# Altium schematic sheet Sheet1.SchDoc
size A3; SheetNumber: 1; SheetTotal: 1; SPICEModelCacheCNQVOYKR: <root> / <DocumentId>CNQVOYKR</DocumentId> / </root>
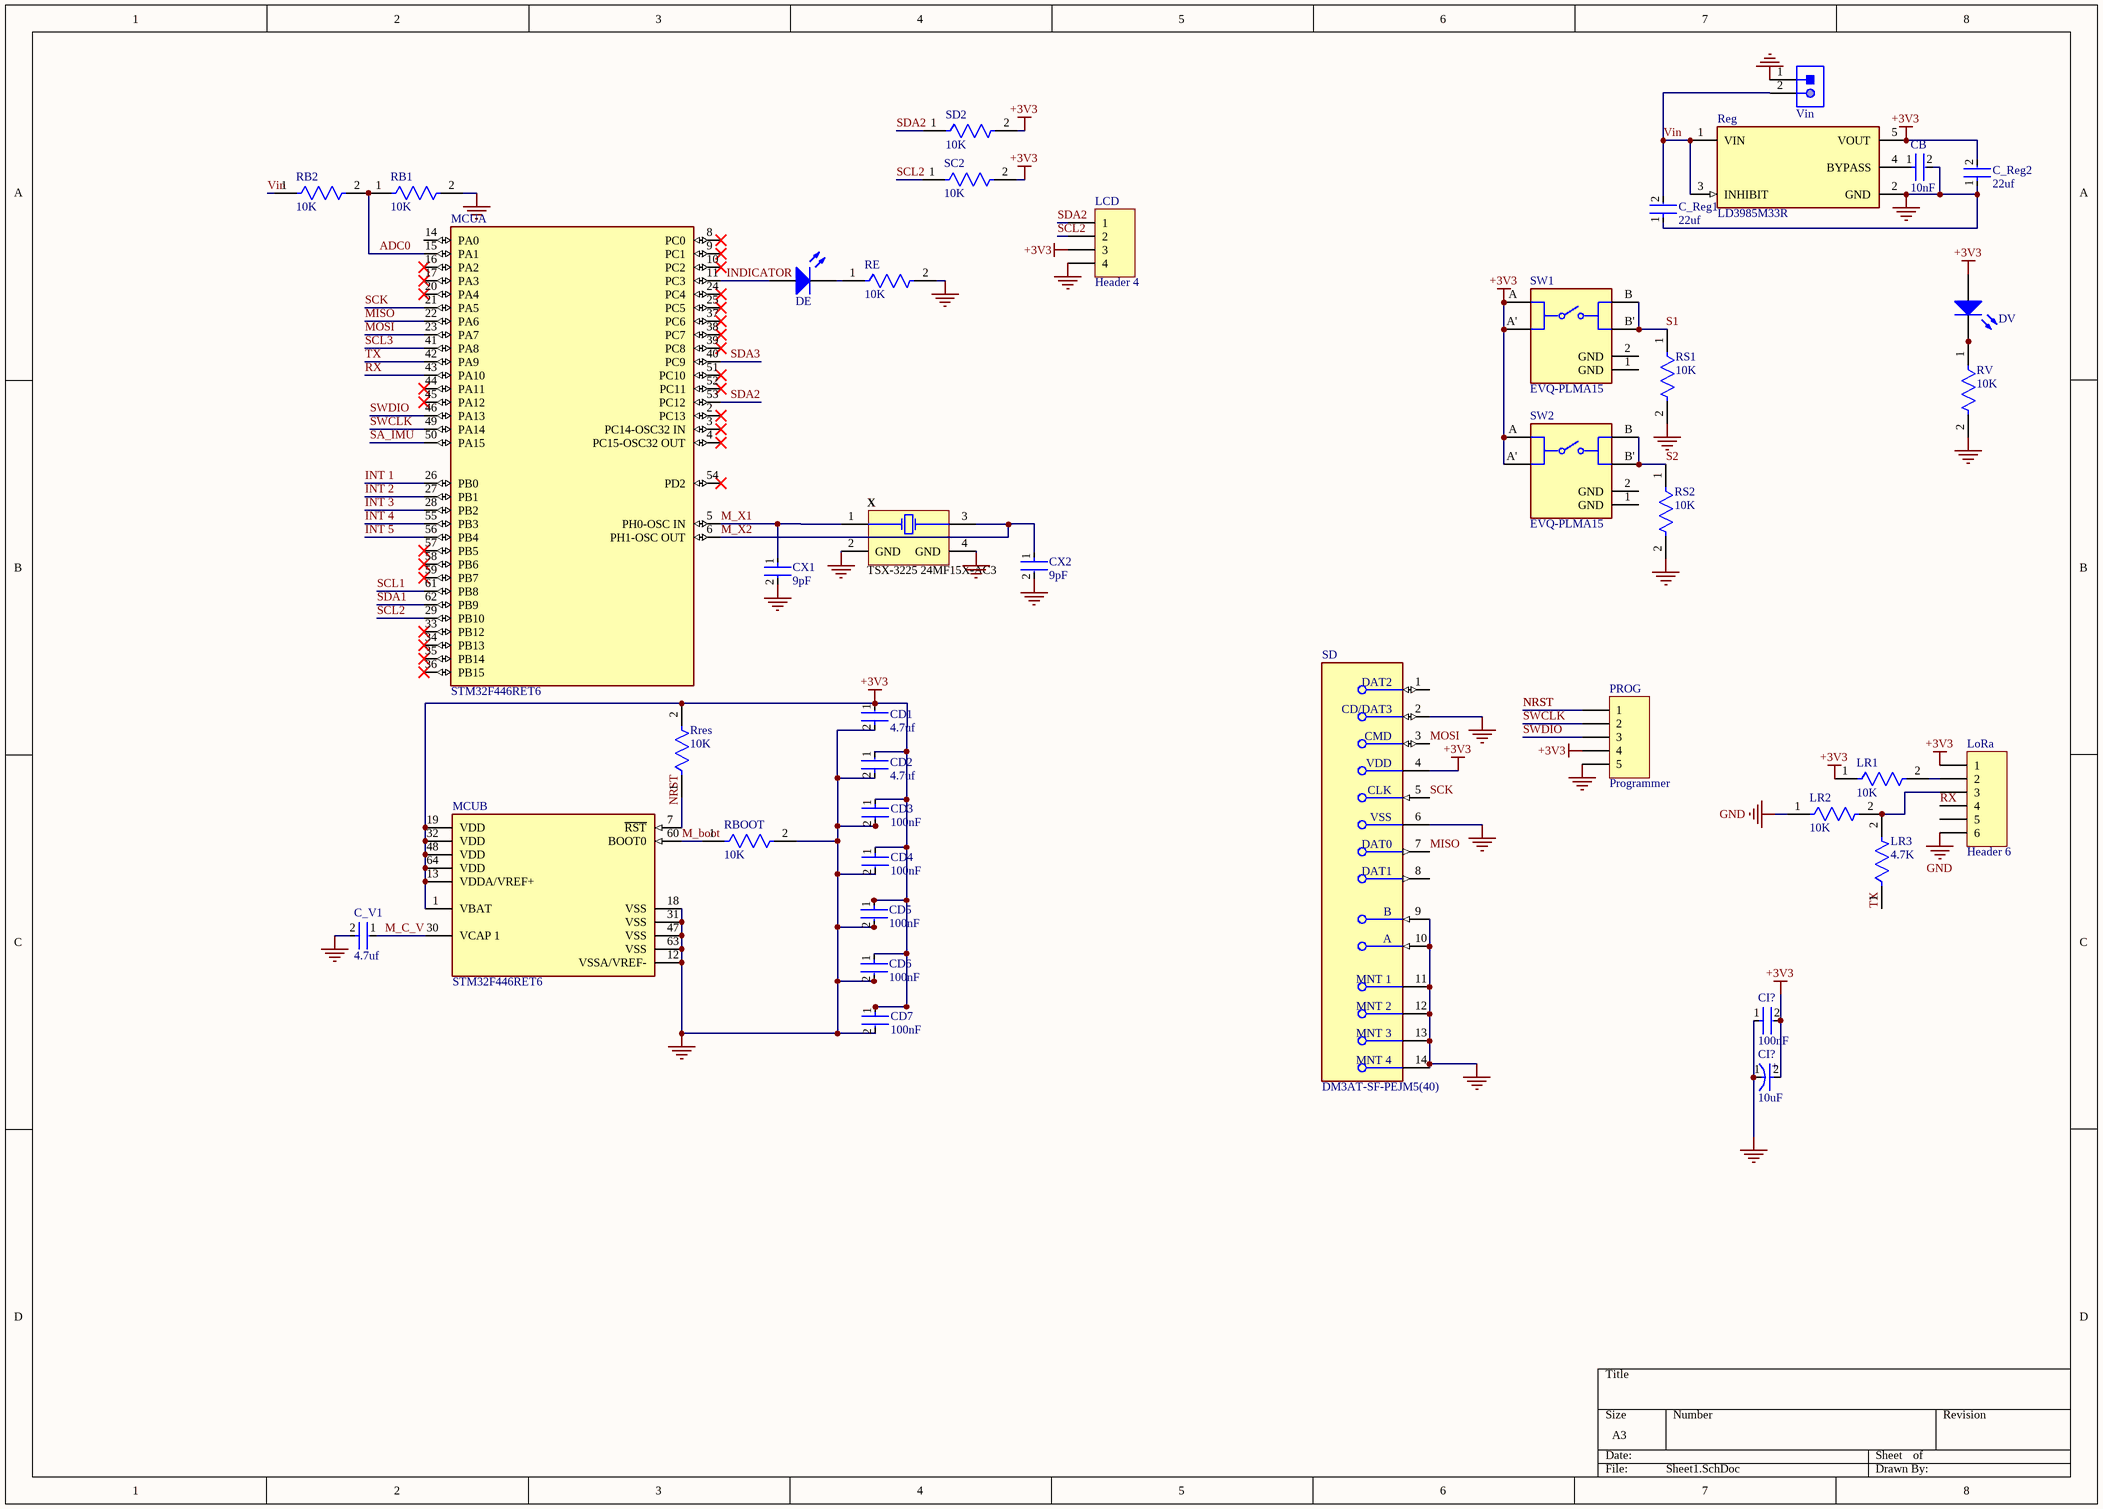
[diagram p0: Sheet1.SchDoc]

## Parts
(Parts that share a designator on the sheet are numbered #1, #2 ... from top to bottom, then left to right.)
C_Reg1  22uf  [FP-C2012-125-0_2-IPC_A]
C_Reg2  22uf  [FP-C2012-125-0_2-IPC_A]
C_V1  4.7uf  [FP-C1608-080-0_1-IPC_C]
CB  10nF  [FP-CC0603-DA-MFG]
CD1  4.7uf  [FP-C1608-080-0_1-IPC_C]
CD2  4.7uf  [FP-C1608-080-0_1-IPC_C]
CD3  100nF  [FP-CGA3E-0_3-0_1-IPC_A]
CD4  100nF  [FP-CGA3E-0_3-0_1-IPC_A]
CD5  100nF  [FP-CGA3E-0_3-0_1-IPC_A]
CD6  100nF  [FP-CGA3E-0_3-0_1-IPC_A]
CD7  100nF  [FP-CGA3E-0_3-0_1-IPC_A]
CI?#1  100nF  [FP-CGA3E-0_3-0_1-IPC_A]
CI?#2  10uF  [FP-SC-MFG]
CX1  9pF  [FP-CGA3E-0_3-0_1-IPC_B]
CX2  9pF  [FP-CGA3E-0_3-0_1-IPC_B]
DE  150080BS75000  [0805_A]  (value not drawn)
DV  150080BS75000  [0805_A]  (value not drawn)
LCD  Header 4  [HDR1X4]
LoRa  Header 6  [HDR1X6]
LR1  10K  [FP-RC0603-0_55-IPC_C]
LR2  10K  [FP-RC0603-0_55-IPC_C]
LR3  4.7K  [FP-RC0603-0_55-IPC_C]
MCU  STM32F446RET6  [FP-LQFP64-5W-MFG]  (parts A,B of 2)
PROG  Programmer  [HDR1X5]
RB1  10K  [FP-RC0603-0_55-IPC_C]
RB2  10K  [FP-RC0603-0_55-IPC_C]
RBOOT  10K  [FP-RC0603-0_55-IPC_C]
RE  10K  [FP-RC0603-0_55-IPC_C]
Reg  LD3985M33R  [FP-SOT23-5L-7049676-MFG]
Rres  10K  [FP-RC0603-0_55-IPC_C]
RS1  10K  [FP-RC0603-0_55-IPC_C]
RS2  10K  [FP-RC0603-0_55-IPC_C]
RV  10K  [FP-RC0603-0_55-IPC_C]
SC2  10K  [FP-RC0603-0_55-IPC_C]
SD  DM3AT-SF-PEJM5(40)  [FP-DM3AT-SF-PEJM5_40-MFG]
SD2  10K  [FP-RC0603-0_55-IPC_C]
SW1  EVQ-PLMA15  [FP-EVQ-PLMA15-MFG]
SW2  EVQ-PLMA15  [FP-EVQ-PLMA15-MFG]
Vin  620302124022  [620302124022]  (value not drawn)
X  TSX-3225 24MF15X-AC3  [EPSON-TSX-3225_V]

## Nets
+3V3: C_Reg2.2 CD1.1 CD2.1 CD3.1 CD4.1 CD5.1 CD6.1 CD7.1 CI?#1.2 CI?#2.2(A) DV.2(A) LCD.3 LoRa.1 LR1.1 MCU.1(VBAT) MCU.13(VDDA/VREF+) MCU.19(VDD) MCU.32(VDD) MCU.48(VDD) MCU.64(VDD) PROG.4 Reg.5(VOUT) Rres.2 SC2.2 SD.4(VDD) SD2.2 SW1.A SW1.A' SW2.A SW2.A'
GND: C_Reg1.1 C_Reg2.1 C_V1.2 CB.2 CD1.2 CD2.2 CD3.2 CD4.2 CD5.2 CD6.2 CD7.2 CI?#1.1 CI?#2.1(C) CX1.2 CX2.2 LCD.4 LoRa.6 LR2.1 MCU.12(VSSA/VREF-) MCU.18(VSS) MCU.31(VSS) MCU.47(VSS) MCU.63(VSS) PROG.5 RB1.2 RBOOT.2 RE.2 Reg.2(GND) RS1.2 RS2.2 RV.2 SD.2(CD/DAT3) SD.6(VSS) SD.9(B) SD.10(A) SD.11(MNT_1) SD.12(MNT_2) SD.13(MNT_3) SD.14(MNT_4) Vin.1 X.2(GND) X.4(GND)
ADC0: MCU.15(PA1) RB1.1 RB2.2
INDICATOR: DE.2(A) MCU.11(PC3)
INT 1: MCU.26(PB0)
INT 2: MCU.27(PB1)
INT 3: MCU.28(PB2)
INT 4: MCU.55(PB3)
INT 5: MCU.56(PB4)
M_boot: MCU.60(BOOT0) RBOOT.1
M_C_V: C_V1.1 MCU.30(VCAP_1)
M_X1: CX1.1 MCU.5(PH0-OSC_IN) X.1(X1)
M_X2: CX2.1 MCU.6(PH1-OSC_OUT) X.3(X2)
MISO: MCU.22(PA6) SD.7(DAT0)
MOSI: MCU.23(PA7) SD.3(CMD)
NRST: MCU.7(~{RST}) PROG.1 Rres.1
RX: LoRa.4 MCU.43(PA10)
S1: RS1.1 SW1.B SW1.B'
S2: RS2.1 SW2.B SW2.B'
SA_IMU: MCU.50(PA15)
SCK: MCU.21(PA5) SD.5(CLK)
SCL1: MCU.61(PB8)
SCL2: LCD.2 MCU.29(PB10) SC2.1
SCL3: MCU.41(PA8)
SDA1: MCU.62(PB9)
SDA2: LCD.1 MCU.53(PC12) SD2.1
SDA3: MCU.40(PC9)
SWCLK: MCU.49(PA14) PROG.2
SWDIO: MCU.46(PA13) PROG.3
TX: LR3.1 MCU.42(PA9)
Vin: C_Reg1.2 RB2.1 Reg.1(VIN) Reg.3(INHIBIT) Vin.2
NetCB_1: CB.1 Reg.4(BYPASS)
NetDE_1: DE.1(K) RE.1
NetDV_1: DV.1(K) RV.1
NetLoRa_2: LoRa.2 LR1.2
NetLoRa_3: LoRa.3 LR2.2 LR3.2

Not connected (* = marked no-connect by the designer): LoRa 5; MCU 2(PC13)* 3(PC14-OSC32_IN)* 4(PC15-OSC32_OUT)* 8(PC0)* 9(PC1)* 10(PC2)* 14(PA0) 16(PA2)* 17(PA3)* 20(PA4)* 24(PC4)* 25(PC5)* 33(PB12)* 34(PB13)* 35(PB14)* 36(PB15)* 37(PC6)* 38(PC7)* 39(PC8)* 44(PA11)* 45(PA12)* 51(PC10)* 52(PC11)* 54(PD2)* 57(PB5)* 58(PB6)* 59(PB7)*; SD 1(DAT2) 8(DAT1); SW1 1(GND) 2(GND); SW2 1(GND) 2(GND)

## Notes on the sheet
- (in symbol CMP-05427-000087-1) +

## Library data of the parts
C_Reg1 C_Reg2 = CMP-08246-007072-1: Multilayer Ceramic Capacitors 22μF ±20% 16V X6S SMD 0805; Mount: Surface Mount; Width: 0.049inch; Packaging: Tape and Reel; Package Quantity: 2000; Voltage Rating: 16V; RoHS Compliant: Yes; Case Code (Imperial): 0805; Case Code (Metric): 2012; Case/Package: 0805; Dielectric: X6S; Capacitance: 22uF; Dielectric Material: Ceramic; Max Operating Temperature: 105°C; Lead Free: Lead Free; Min Operating Temperature: -55°C; Tolerance: 20%; Height: 1.25mm; Thickness: 0.057inch; Termination: SMD/SMT; Series: C; REACH SVHC: No SVHC; Weight: 0.000194oz; Voltage Rating (DC): 16V; Length: 0.079inch
C_V1 CD1 CD2 = CMP-2000-04981-2: Multilayer Ceramic Capacitors 4.7μF ±10% 16V X5R SMD 0603; Tolerance: 10%; Thickness: 0.035inch; Length: 1.6mm; Width: 0.031inch; Height: 0.8mm; Package Quantity: 1; Voltage: 16V; Construction: Flat; Weight: 7.1E-05oz; Depth: 0.8mm; Case Code (Metric): 1608; Series: C; Lead Free: Lead Free; Voltage Rating: 16V; Voltage Rating (DC): 16V; Capacitance: 4.7uF; Termination: SMD/SMT; Dielectric: X5R; REACH SVHC: No SVHC; RoHS Compliant: Yes; Case Code (Imperial): 0603; Case/Package: 0603; Mount: Surface Mount; Dielectric Material: Ceramic; Packaging: Tape and Reel; Min Operating Temperature: -55°C; Max Operating Temperature: 85°C
CB = CMP-2100-03600-2: CAP CER 10000PF 50V X7R 0603; Manufacturer Part Number: CC0603KRX7R9BB103; Manufacturer: YAGEO; Tolerance: 0.1; Temperature Coefficient: 15%; Mouser Description: Multilayer Ceramic Capacitor, CC Series, 0.01 - F, - 10%, X7R, 50 V, 0603 [1608 Metric]; Digikey Description: CAP CER 10000PF 50V X7R 0603; Height: 0.9mm; Category: Cap; Temperature Characteristic: X7R; Footprint Url: http://www.yageo.com/exep/pages/download/literatures/UPY-C_GEN_24.pdf; Lead Free: Yes; Voltage Rating: 50 V; Material: Ceramic; Temperature: -55°C to +125°C; Device Class L3: Ceramic Capacitors; ComponentLink2Description: Datasheet; Voltage: 50 V; Package: CC0603-DA; Octopart: https://octopart.com/cc0603krx7r9bb103-yageo-192938; Automotive: No; Temperature Range High: +125°C; Temperature Range Low: -55°C; Value: 10 nF; RoHS: TRUE; Device Class L1: Passive Components; ComponentLink2URL: http://www.yageo.com/documents/recent/UPY-GPHC_X7R_6.3V-to-50V_18.pdf; Device Class L2: Capacitors; Capacitance: 10 nF
CD3-CD7 CI?#1 = CMP-2000-07546-2: Cap Ceramic 100nF 50V X7R 10% Pad SMD 0603 +125°C Automotive T/R; Weight: 7.1E-05oz; Composition: Ceramic; Max Operating Temperature: 125°C; Termination: SMD/SMT; Dielectric: X7R; Length: 1.6mm; Package Quantity: 1; REACH SVHC: No SVHC; Lead Free: Lead Free; Case Code (Metric): 1608; Min Operating Temperature: -55°C; Packaging: Tape and Reel; Tolerance: 10%; Voltage Rating: 50V; Case Code (Imperial): 0603; Capacitance: 100nF; Case/Package: 0603; Voltage Rating (DC): 50V; Depth: 0.8mm; Radiation Hardening: No; Ratings: AEC-Q200; Mount: Surface Mount; Voltage: 50V; Thickness: 0.035inch; Width: 0.8mm; Height: 0.8mm
CI?#2 = CMP-05427-000087-1: CAP ALUM 10UF 20% 35V SMD; Life (Hours): 2000Hour; Lead Length: 2.2mm; Ripple Current (AC): 30mA; Leakage Current: 3uA; Length: 5.5mm; Construction: Cylindrical; Diameter: 5mm; RoHS Compliant: Yes; REACH SVHC: No SVHC; Capacitance: 10uF; Max Operating Temperature: 85°C; Series: S; Case/Package: Radial; Contact Plating: Tin; Packaging: Tape and Reel; Voltage Rating: 35V; Number of Pins: 2; Height: 5.4mm; Width: 5.3mm; Voltage Rating (DC): 35V; Mount: Surface Mount; Tolerance: 20%; Lead Pitch: 1.5mm; Radiation Hardening: No; Height - Seated (Max): 0.213inch; Ripple Current: 30mA; Voltage: 35V; Package Quantity: 1; Termination: SMD/SMT; Min Operating Temperature: -40°C
CX1 CX2 = CMP-08246-000963-1: Cap Ceramic 9pF 50V C0G 0.5pF Pad SMD 0603 +125°C Automotive T/R; Width: 0.031inch; Package Quantity: 4000; Composition: Ceramic; Depth: 0.8mm; Ratings: AEC-Q200; Packaging: Tape and Reel; Weight: 7.1E-05oz; Mount: Surface Mount; Max Operating Temperature: 125°C; Length: 1.6mm; Voltage Rating (DC): 50V; Voltage Rating: 50V; Case Code (Metric): 1608; REACH SVHC: No SVHC; Case Code (Imperial): 0603; Thickness: 0.035inch; Termination: SMD/SMT; Dielectric: C0G; Min Operating Temperature: -55°C; Case/Package: 0603; Capacitance: 9pF; Height: 0.8mm
DE DV = CMP-1426-00008-1: SMD mono-color Chip LED, WL-SMCW, Blue; Manufacturer: Wuerth Elektronik; Color: Blue; ComponentLink2URL: http://katalog.we-online.com/led/datasheet/150080BS75000.pdf; ComponentLink1URL: http://www.we-online.com; ComponentLink2Description: Datasheet; PackageReference: 0805_A; ComponentLink1Description: Manufacturer URL; PartNumber: 150080BS75000
LCD = Header 4: Header, 4-Pin; LatestRevisionDate: 17-Jul-2002; LatestRevisionNote: Re-released for DXP Platform.; Publisher: Altium Limited
LoRa = Header 6: Header, 6-Pin; LatestRevisionDate: 17-Jul-2002; LatestRevisionNote: Re-released for DXP Platform.; Publisher: Altium Limited
LR1-LR3 RB1 RB2 RBOOT RE Rres RS1 RS2 RV SC2 SD2 = CMP-2100-03664-2: RES 10K OHM 1% 1/10W 0603; Voltage Rating: 75V; Voltage Rating (DC): 50V; Resistance: 10kR; Power Rating: 100mW; Temperature Coefficient: 100ppm/°C; Depth: 0.8mm; Termination: SMD/SMT; Resistor Type: Thick Film; Series: RC; Construction: Rectangular; Features: Moisture Resistant; Packaging: Tape and Reel; Min Operating Temperature: -55°C; Number of Terminations: 2; Lead Pitch: 0.3mm; RoHS Compliant: Yes; Case/Package: 0603; Resistance Tolerance: 1%; Military Standard: Not; Weight: 7.1E-05oz; Number of Pins: 2; Tolerance: 1%; Length: 1.6mm; Case Code (Imperial): 0603; Lead Free: Lead Free; Width: 0.8mm; Max Power Dissipation: 100mW; Height: 0.45mm; Max Operating Temperature: 155°C; Case Code (Metric): 1608; Size Code: 0603
MCU = CMP-12105-000007-1: IC MCU 32BIT 512KB FLASH 64LQFP; Manufacturer: ST; Number Of Spi Channels: 4; Ram Size: 128KBytes; Standoff Height: 0.05mm; Number Of Uart Channels: 6; Number Of Pwm Channels: 32; Max Junction Temp: +105°C; Number Of I/Os: 50; Number Of Usb Channels: 2; Frequency: 180MHz; Number Of A/D Converters: 3; Max Supply Voltage: 3.6V; Number Of Adc Channels: 16; Interface: I2C,SPI,UART,USART,CAN,USB,LIN,IrDA,I2S,Other; Memory Size: 512KBytes; Number Of Timers/Counters: 14; Min Supply Voltage: 1.7V; Core Architecture: ARM Cortex-M4; Data Bus Width: 32bits; Number Of Cores: 1; Ambient Temperature Range Low: -40°C; ComponentLink2URL: https://www.st.com/en/microcontrollers-microprocessors/stm32f446re.html; Category: IC; Height: 1.6mm; Ipc Land Pattern Name: QFP50P1200X1200X160-64; Manufacturer Part Number: STM32F446RET6; Octopart: https://octopart.com/stm32f446ret6-stmicroelectronics-52642920; Temperature Range High: +105°C; Lead Free: Yes; Mouser Description: ARM Microcontrollers - MCU High-performance and DSP with FP, ARM Cortex-M4 MCU with 512 Kbytes Flash, 180 MHz CPU, Art Accelerator, SDRAM; Digikey Description: IC MCU 32BIT 512KB FLASH 64LQFP; Ambient Temperature Range High: +85°C; Number Of I2C Channels: 4; Memory Type: FLASH; RoHS: TRUE; Automotive: No; Device Class L1: Integrated Circuits (ICs); Temperature: -40°C to +105°C; Device Class L2: Embedded Processors and Controllers; Device Class L3: Microcontrollers; Temperature Range Low: -40°C; Package: LQFP64-5W; ComponentLink2Description: Datasheet
PROG = Header 5: Header, 5-Pin; LatestRevisionDate: 17-Jul-2002; LatestRevisionNote: Re-released for DXP Platform.; Publisher: Altium Limited
Reg = CMP-0244-00328-2: IC REG LINEAR 3.3V 150MA SOT23-5; Input Bias Current: 85uA; Output Type: Fixed; Max Input Voltage: 6V; Min Input Voltage: 2.5V; Output Voltage Accuracy: 2%; Quiescent Current: 150uA; Number of Regulators: 1; Min Current Limit: 300mA; Dropout Voltage: 60mV; Polarity: Positive; Min Operating Temperature: -40°C; Height: 1.3mm; Radiation Hardening: No; Package Quantity: 1; Number of Pins: 5; Output Current: 150mA; Width: 1.75mm; Length: 3mm; Mount: Surface Mount; Case/Package: SOT-23; Lead Free: Lead Free; Number of Outputs: 1; Max Operating Temperature: 125°C; Accuracy: 2%; Max Output Current: 150mA; Packaging: Tape and Reel; Output Voltage: 3.3V; Min Output Voltage: 3.3V
SD = CMP-11597-000006-1: CONN MICRO SD R/A PUSH-PUSH SMD; Contact Resistance: 100mR; Insulation Resistance: 1GR; Gender: Receptacle; Max Voltage Rating (AC): 125V; Pitch: 1.1mm; Mating Cycles: 10000; Max Current Rating: 500mA; Connector Type: Connector; Number of Contacts: 8; Housing Material: Polymer; Flammability Rating: UL94 V-0; REACH SVHC: No SVHC; Lead Free: Lead Free; Package Quantity: 400; Length: 13.85mm; Number of Rows: 2; Series: DM3; Min Operating Temperature: -25°C; Voltage Rating (AC): 125V; Contact Material: Copper Alloy; Depth: 15.95mm; Contact Plating: Gold; Packaging: Tape and Reel; Width: 13.85mm; Orientation: Right Angle; Color: Black; Voltage Rating: 125V; Radiation Hardening: No; Termination: Solder; Current Rating: 500mA; Mount: Surface Mount; Max Operating Temperature: 85°C
SW1 SW2 = CMP-05618-000006-1: SWITCH TACTILE SPST-NO 0.02A 15V; Manufacturer: Panasonic Electronic Components; Operating Force: 2.6N; Contact Resistance: 50mΩ; Contact Current Rating: 20mA; Electromechanical Life: 200000Cycles; Throw Configuration: SPST-NO; Automotive: No; Digikey Description: SWITCH TACTILE SPST-NO 0.02A 15V; Device Class L3: Tactile Switches; Device Class L2: Switches; Temperature Range Low: -20°C; ComponentLink2Description: Datasheet; RoHS: TRUE; Mount: Surface Mount; Package: 0; Height: 1.7mm; Octopart: https://octopart.com/evq-plma15-panasonic-39850235; Temperature Range High: +70°C; Device Class L1: Electromechanical; Category: Switch; Mouser Description: Tactile Switches FLAT ACT 2.6NF 4.6x3.4x1.5mm; Voltage Rating Dc: 15V; Manufacturer Part Number: EVQ-PLMA15; ComponentLink2URL: https://datasheet.ciiva.com/8164/atv0000ce2-8164994.pdf; Lead Free: Yes; Temperature: -20°C to +70°C
Vin = CMP-1502-00660-1: Male Shrouded Header WR-WTB, SMT, Vertical, pitch 2 mm, 1 x 2 position; Manufacturer: Wurth Elektronik; Pitch: 2mm; Position: 1x2; Working Voltage: 100VAC; Contact Resistance: 20mOhm; Package Reference: 620302124022; Manufacturer URL: http://www.we-online.de; Gender: Male; Orientation: Vertical; Publisher: WurthElektronik; Mounting Technology: SMT; Operating Temperature: -25to85degC; Datasheet URL: https://katalog.we-online.de/em/datasheet/6203xx124022.pdf; Packaging: TapeandReel; Part Number: 620302124022
X = CMP-2000-07333-1: MHz Range Crystal, 24 MHz, -40 to 85 degC, 4-Pin SMD, RoHS, Tape and Reel; Manufacturer: Epson; Brand: EpsonTiming; Frequency Stability: 10PPM; Frequency: 24MHz; ESR: 40Ohms; Load Capacitance: 9pF; Unit Weight: 0.000564oz; Drive Level: 200uW; Datasheet Version: 12/2015; RoHS: True; Operating Temperature Range: -40Cto+85C; Length: 3.2mm; Tolerance: 10PPM; Width: 2.5mm; Mounting Technology: SurfaceMount; Package Description: 4-Pin Surface Mount Device, Body 3.2 x 2.5 mm; Manufacturer URL: https://www.eea.epson.com/; Factory Pack Quantity: 250; Package Reference: TSX-3225; Height: 0.6mm; Mounting Style: SMD/SMT; Termination Style: SMD/SMT; Datasheet URL: https://support.epson.biz/td/api/doc_check.php?dl=brief_FA-238V_en.pdf; Type: Crystal; Series: TSX-3225; Package / Case: 3.2mmx2.5mm; Product Category: Crystals; Packaging: Reel